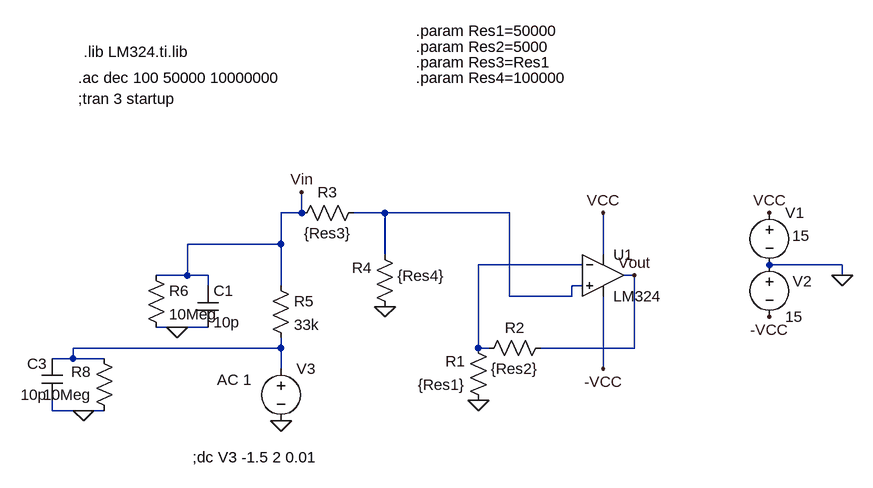
[diagram p0: schematic simulacion_b.asc]
simulacion_b.asc, the LTspice schematic file:
Version 4
SHEET 1 880 680
WIRE -208 32 -208 0
WIRE -208 32 -240 32
WIRE -80 32 -128 32
WIRE 112 32 -80 32
WIRE -240 80 -240 32
WIRE -240 80 -384 80
WIRE -80 96 -80 32
WIRE 256 96 256 32
WIRE 224 112 64 112
WIRE 624 112 512 112
WIRE -384 128 -384 80
WIRE -384 128 -432 128
WIRE -352 128 -384 128
WIRE 304 128 288 128
WIRE 624 128 624 112
WIRE -352 144 -352 128
WIRE -240 144 -240 80
WIRE 224 144 208 144
WIRE 112 160 112 32
WIRE 208 160 208 144
WIRE 208 160 112 160
WIRE -400 208 -432 208
WIRE -352 208 -400 208
WIRE -240 240 -240 224
WIRE -240 240 -560 240
WIRE 64 240 64 112
WIRE 80 240 64 240
WIRE 304 240 304 128
WIRE 304 240 160 240
WIRE -560 256 -560 240
WIRE -560 256 -592 256
WIRE -512 256 -560 256
WIRE -240 272 -240 240
WIRE 256 272 256 160
WIRE -592 336 -592 320
WIRE -544 336 -592 336
WIRE -512 336 -544 336
FLAG 624 128 0
FLAG 512 32 VCC
FLAG 256 32 VCC
FLAG 256 272 -VCC
FLAG 512 192 -VCC
FLAG -240 352 0
FLAG -208 0 Vin
FLAG 64 320 0
FLAG -80 176 0
FLAG 304 128 Vout
FLAG -400 208 0
FLAG -544 336 0
SYMBOL Opamps\\opamp2 256 64 R0
SYMATTR InstName U1
SYMATTR Value LM324
SYMBOL voltage 512 16 R0
WINDOW 3 35 51 Left 2
WINDOW 123 0 0 Left 2
WINDOW 39 0 0 Left 2
SYMATTR Value 15
SYMATTR InstName V1
SYMBOL voltage 512 96 R0
WINDOW 0 36 41 Left 2
WINDOW 123 0 0 Left 2
WINDOW 39 0 0 Left 2
SYMATTR InstName V2
SYMATTR Value 15
SYMBOL voltage -240 256 R0
WINDOW 123 -98 33 Left 2
WINDOW 39 0 0 Left 2
SYMATTR Value2 AC 1
SYMATTR Value ""
SYMATTR InstName V3
SYMBOL res 80 336 R180
WINDOW 0 36 76 Left 2
WINDOW 3 36 40 Left 2
SYMATTR InstName R1
SYMATTR Value {Res1}
SYMBOL res 176 224 R90
WINDOW 0 0 56 VBottom 2
WINDOW 3 32 56 VTop 2
SYMATTR InstName R2
SYMATTR Value {Res2}
SYMBOL res -224 48 R270
WINDOW 0 32 56 VTop 2
WINDOW 3 0 56 VBottom 2
SYMATTR InstName R3
SYMATTR Value {Res3}
SYMBOL res -64 192 R180
WINDOW 0 36 76 Left 2
WINDOW 3 -76 63 Left 2
SYMATTR InstName R4
SYMATTR Value {Res4}
SYMBOL res -256 128 R0
SYMATTR InstName R5
SYMATTR Value 33k
SYMBOL res -448 112 R0
SYMATTR InstName R6
SYMATTR Value 10Meg
SYMBOL cap -368 144 R0
SYMATTR InstName C1
SYMATTR Value 10p
SYMBOL res -496 352 R180
WINDOW 0 36 76 Left 2
WINDOW 3 36 40 Left 2
SYMATTR InstName R8
SYMATTR Value 10Meg
SYMBOL cap -576 320 R180
WINDOW 0 24 56 Left 2
WINDOW 3 24 8 Left 2
SYMATTR InstName C3
SYMATTR Value 10p
TEXT -552 -144 Left 2 !;tran 3 startup
TEXT -544 -216 Left 2 !.lib LM324.ti.lib
TEXT -552 -176 Left 2 !.ac dec 100 50000 10000000
TEXT -32 -248 Left 2 !.param Res1=50000
TEXT -32 -224 Left 2 !.param Res2=5000
TEXT -32 -200 Left 2 !.param Res3=Res1
TEXT -32 -176 Left 2 !.param Res4=100000
TEXT -376 408 Left 2 !;dc V3 -1.5 2 0.01

The netlist it stands for:
* simulacion_b.asc
XU1 N001 N002 VCC -VCC Vout LM324  ; pins In+ In- V+ V- OUT
V1 VCC 0 15
V2 0 -VCC 15
V3 N003 0 AC 1
R1 0 N002 {Res1}
R2 Vout N002 {Res2}
R3 Vin N001 {Res3}
R4 0 N001 {Res4}
R5 Vin N003 33k
R6 Vin 0 10Meg
C1 Vin 0 10p
R8 0 N003 10Meg
C3 0 N003 10p
;tran 3 startup
.lib LM324.ti.lib
.ac dec 100 50000 10000000
.param Res1=50000
.param Res2=5000
.param Res3=Res1
.param Res4=100000
;dc V3 -1.5 2 0.01
.backanno
.end